# Altium schematic sheet CCD.SchDoc
size A3
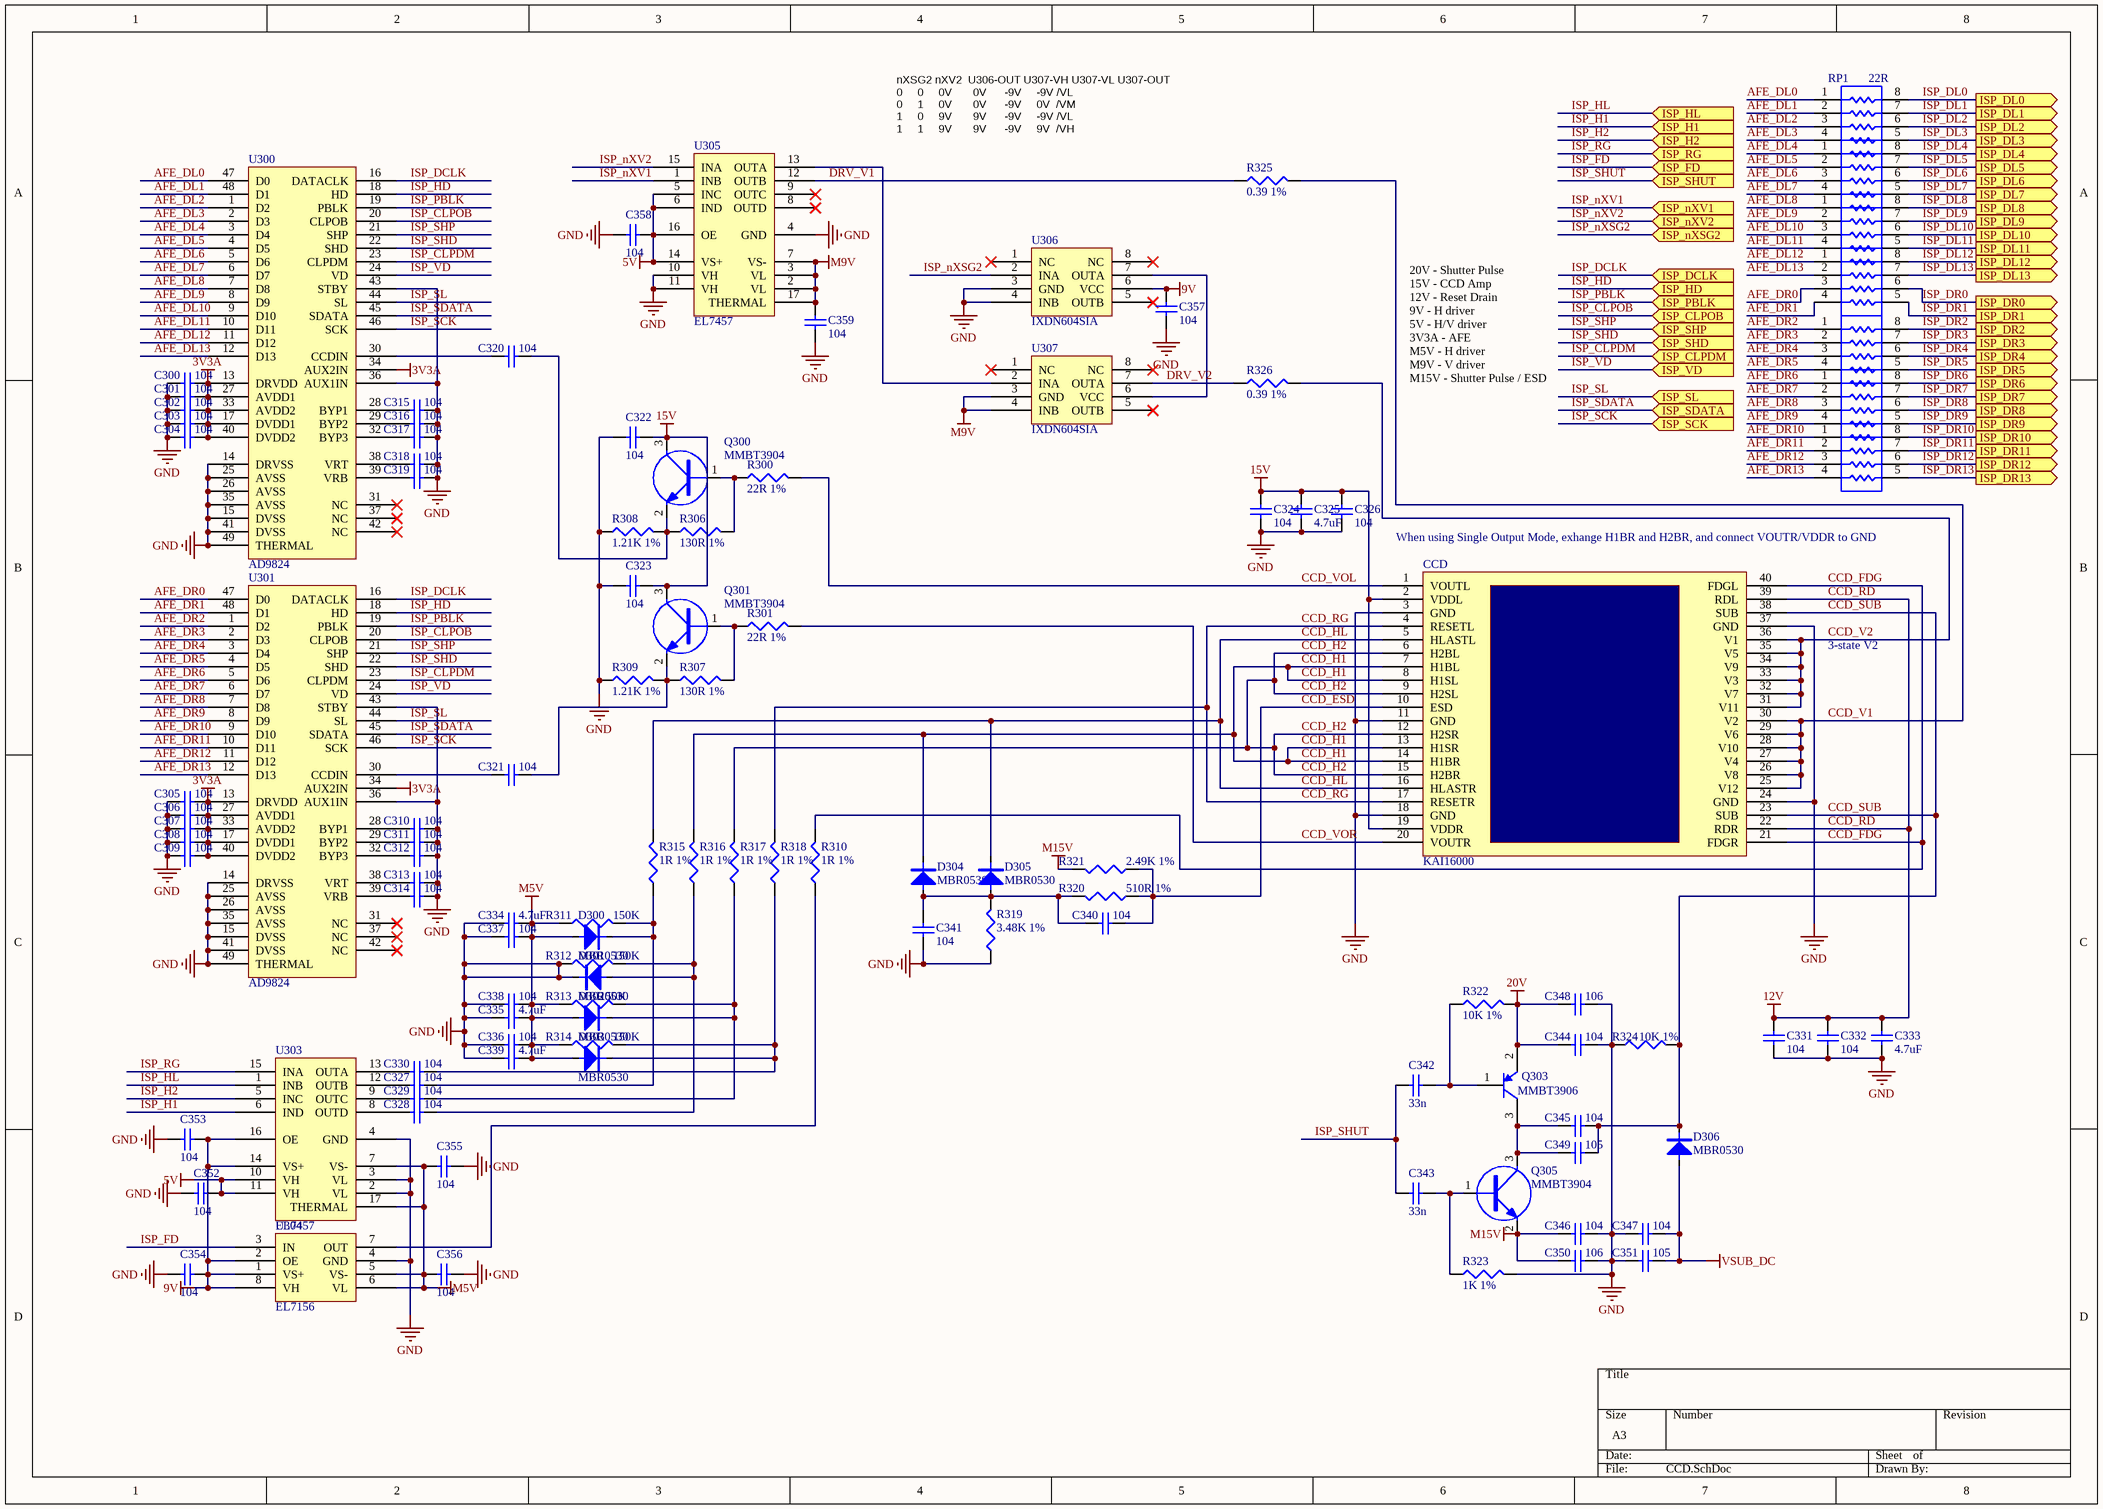
[diagram p0: CCD.SchDoc]

## Parts
C300  104  [C0402]
C301  104  [C0402]
C302  104  [C0402]
C303  104  [C0402]
C304  104  [C0402]
C305  104  [C0402]
C306  104  [C0402]
C307  104  [C0402]
C308  104  [C0402]
C309  104  [C0402]
C310  104  [C0402]
C311  104  [C0402]
C312  104  [C0402]
C313  104  [C0402]
C314  104  [C0402]
C315  104  [C0402]
C316  104  [C0402]
C317  104  [C0402]
C318  104  [C0402]
C319  104  [C0402]
C320  104  [C0402]
C321  104  [C0402]
C322  104  [C0402]
C323  104  [C0402]
C324  104  [C0402]
C325  4.7uF  [C0603]
C326  104  [C0402]
C327  104  [C0402]
C328  104  [C0402]
C329  104  [C0402]
C330  104  [C0402]
C331  104  [C0402]
C332  104  [C0402]
C333  4.7uF  [C0603]
C334  104  [C0603]
C335  4.7uF  [C0603]
C336  104  [C0603]
C337  4.7uF  [C0603]
C338  104  [C0603]
C339  4.7uF  [C0603]
C340  104  [C0603]
C341  104  [C0603]
C342  33n  [C0402]
C343  33n  [C0402]
C344  104  [C0402]
C345  104  [C0402]
C346  104  [C0402]
C347  104  [C0402]
C348  106  [C0805]
C349  105  [C0805]
C350  106  [C0805]
C351  105  [C0805]
C352  104  [C0603]
C353  104  [C0603]
C354  104  [C0603]
C355  104  [C0603]
C356  104  [C0603]
C357  104  [C0603]
C358  104  [C0603]
C359  104  [C0603]
CCD  KAI16000  [KAI16000]
D300  MBR0530  [SOD123]
D301  MBR0530  [SOD123]
D302  MBR0530  [SOD123]
D303  MBR0530  [SOD123]
D304  MBR0530  [SOD123]
D305  MBR0530  [SOD123]
D306  MBR0530  [SOD123]
Q300  MMBT3904  [SOT23]
Q301  MMBT3904  [SOT23]
Q303  MMBT3906  [SOT23]
Q305  MMBT3904  [SOT23]
R300  22R 1%  [R0603]
R301  22R 1%  [R0603]
R306  130R 1%  [R0603]
R307  130R 1%  [R0603]
R308  1.21K 1%  [R0603]
R309  1.21K 1%  [R0603]
R310  1R 1%  [R0805]
R311  150K  [R0603]
R312  150K  [R0603]
R313  150K  [R0603]
R314  150K  [R0603]
R315  1R 1%  [R0805]
R316  1R 1%  [R0805]
R317  1R 1%  [R0805]
R318  1R 1%  [R0805]
R319  3.48K 1%  [R0603]
R320  510R 1%  [R0603]
R321  2.49K 1%  [R0603]
R322  10K 1%  [R0603]
R323  1K 1%  [R0603]
R324  10K 1%  [R0603]
R325  0.39 1%  [R0603]
R326  0.39 1%  [R0603]
RP1  22R  [R0402S4]
RP2  22R  [R0402S4]  (value not drawn)
RP3  22R  [R0402S4]  (value not drawn)
RP4  22R  [R0402S4]  (value not drawn)
RP5  22R  [R0402S4]  (value not drawn)
RP6  22R  [R0402S4]  (value not drawn)
RP7  22R  [R0402S4]  (value not drawn)
U300  AD9824  [CP-48]
U301  AD9824  [CP-48]
U303  EL7457  [QFN16]
U304  EL7156  [SOP-8]
U305  EL7457  [QFN16]
U306  IXDN604SIA  [SOP8]
U307  IXDN604SIA  [SOP8]

## Ports
ISP_CLPDM (in), ISP_CLPOB (in), ISP_DCLK (in), ISP_DL0 (out), ISP_DL1 (out), ISP_DL2 (out), ISP_DL3 (out), ISP_DL4 (out), ISP_DL5 (out), ISP_DL6 (out), ISP_DL7 (out), ISP_DL8 (out), ISP_DL9 (out), ISP_DL10 (out), ISP_DL11 (out), ISP_DL12 (out), ISP_DL13 (out), ISP_DR0 (out), ISP_DR1 (out), ISP_DR2 (out), ISP_DR3 (out), ISP_DR4 (out), ISP_DR5 (out), ISP_DR6 (out), ISP_DR7 (out), ISP_DR8 (out), ISP_DR9 (out), ISP_DR10 (out), ISP_DR11 (out), ISP_DR12 (out), ISP_DR13 (out), ISP_FD (in), ISP_H1 (in), ISP_H2 (in), ISP_HD (in), ISP_HL (in), ISP_nXSG2 (in), ISP_nXV1 (in), ISP_nXV2 (in), ISP_PBLK (in), ISP_RG (in), ISP_SCK (in), ISP_SDATA (in), ISP_SHD (in), ISP_SHP (in), ISP_SHUT (in), ISP_SL (in), ISP_VD (in)

## Nets
3V3A: C300.2 C301.2 C302.2 C303.2 C304.2 C305.2 C306.2 C307.2 C308.2 C309.2 U300.13(DRVDD) U300.17(DVDD1) U300.27(AVDD1) U300.33(AVDD2) U300.34(AUX2IN) U300.40(DVDD2) U301.13(DRVDD) U301.17(DVDD1) U301.27(AVDD1) U301.33(AVDD2) U301.34(AUX2IN) U301.40(DVDD2)
5V: C352.2 C358.2 U303.10(VH) U303.11(VH) U305.5(INC) U305.6(IND) U305.14(VS+) U305.16(OE)
9V: C353.1 C354.1 C357.1 U303.14(VS+) U303.16(OE) U304.1(VS+) U304.2(OE) U304.8(VH) U306.6(VCC)
15V: C322.2 C323.2 C324.2 C325.2 C326.2 CCD.2(VDDL) CCD.19(VDDR) Q300.3(C) Q301.3(C)
20V: C344.1 C348.1 Q303.2(E) R322.2
CCD_RD: C331.2 C332.2 C333.2 CCD.22(RDR) CCD.39(RDL)  [also labelled 12V]
GND: C300.1 C301.1 C302.1 C303.1 C304.1 C305.1 C306.1 C307.1 C308.1 C309.1 C310.2 C311.2 C312.2 C313.2 C314.2 C315.2 C316.2 C317.2 C318.2 C319.2 C322.1 C323.1 C324.1 C325.1 C326.1 C331.1 C332.1 C333.1 C334.1 C335.1 C336.1 C337.1 C338.1 C339.1 C341.1 C344.2 C346.2 C347.1 C348.2 C350.2 C351.1 C352.1 C353.2 C354.2 C355.1 C356.1 C357.2 C358.1 C359.1 CCD.3(GND) CCD.11(GND) CCD.18(GND) CCD.24(GND) CCD.37(GND) D301.2 R308.1 R309.1 R312.1 R319.1 R323.2 R324.1 U300.14(DRVSS) U300.15(DVSS) U300.25(AVSS) U300.26(AVSS) U300.35(AVSS) U300.36(AUX1IN) U300.41(DVSS) U300.43(STBY) U300.49(THERMAL) U301.14(DRVSS) U301.15(DVSS) U301.25(AVSS) U301.26(AVSS) U301.35(AVSS) U301.36(AUX1IN) U301.41(DVSS) U301.43(STBY) U301.49(THERMAL) U303.2(VL) U303.3(VL) U303.4(GND) U304.4(GND) U305.4(GND) U305.10(VH) U305.11(VH) U306.3(GND) U306.4(INB)
M5V: C334.2 C335.2 C336.2 C337.2 C338.2 C339.2 C355.2 C356.2 D300.1 D302.1 D303.1 R311.1 R313.1 R314.1 U303.7(VS-) U303.17(THERMAL) U304.5(VS-) U304.6(VL)
M9V: C359.2 U305.2(VL) U305.3(VL) U305.7(VS-) U305.17(THERMAL) U307.3(GND) U307.4(INB)
M15V: C346.1 C350.1 Q305.2(E) R321.2
VSUB_DC: C347.2 C351.2 D306.1
AFE_DL0: RP1.1 U300.47(D0)
AFE_DL1: RP1.2 U300.48(D1)
AFE_DL2: RP1.3 U300.1(D2)
AFE_DL3: RP1.4 U300.2(D3)
AFE_DL4: RP2.1 U300.3(D4)
AFE_DL5: RP2.2 U300.4(D5)
AFE_DL6: RP2.3 U300.5(D6)
AFE_DL7: RP2.4 U300.6(D7)
AFE_DL8: RP3.1 U300.7(D8)
AFE_DL9: RP3.2 U300.8(D9)
AFE_DL10: RP3.3 U300.9(D10)
AFE_DL11: RP3.4 U300.10(D11)
AFE_DL12: RP4.1 U300.11(D12)
AFE_DL13: RP4.2 U300.12(D13)
AFE_DR0: RP4.3 U301.47(D0)
AFE_DR1: RP4.4 U301.48(D1)
AFE_DR2: RP5.1 U301.1(D2)
AFE_DR3: RP5.2 U301.2(D3)
AFE_DR4: RP5.3 U301.3(D4)
AFE_DR5: RP5.4 U301.4(D5)
AFE_DR6: RP7.1 U301.5(D6)
AFE_DR7: RP7.2 U301.6(D7)
AFE_DR8: RP7.3 U301.7(D8)
AFE_DR9: RP7.4 U301.8(D9)
AFE_DR10: RP6.1 U301.9(D10)
AFE_DR11: RP6.2 U301.10(D11)
AFE_DR12: RP6.3 U301.11(D12)
AFE_DR13: RP6.4 U301.12(D13)
CCD_ESD: C340.2 CCD.10(ESD) R320.1 R321.1
CCD_FDG: CCD.21(FDGR) CCD.40(FDGL) R310.2
CCD_H1: CCD.7(H1BL) CCD.8(H1SL) CCD.13(H1SR) CCD.14(H1BR) D304.2 R316.2
CCD_H2: CCD.6(H2BL) CCD.9(H2SL) CCD.12(H2SR) CCD.15(H2BR) R317.2
CCD_HL: CCD.5(HLASTL) CCD.16(HLASTR) D305.2 R315.2
CCD_RG: CCD.4(RESETL) CCD.17(RESETR) R318.2
CCD_SUB: C345.2 C349.2 CCD.23(SUB) CCD.38(SUB) D306.2 R324.2
CCD_V1: CCD.25(V12) CCD.26(V8) CCD.27(V4) CCD.28(V10) CCD.29(V6) CCD.30(V2) R325.2
CCD_V2: CCD.31(V11) CCD.32(V7) CCD.33(V3) CCD.34(V9) CCD.35(V5) CCD.36(V1) R326.2
CCD_VOL: CCD.1(VOUTL) R300.2
CCD_VOR: CCD.20(VOUTR) R301.2
DRV_V1: R325.1 U305.12(OUTB)
DRV_V2: R326.1 U307.7(OUTA)
ISP_CLPDM: U300.23(CLPDM) U301.23(CLPDM) ; port ISP_CLPDM
ISP_CLPOB: U300.20(CLPOB) U301.20(CLPOB) ; port ISP_CLPOB
ISP_DCLK: U300.16(DATACLK) U301.16(DATACLK) ; port ISP_DCLK
ISP_DL0: RP1.8 ; port ISP_DL0
ISP_DL1: RP1.7 ; port ISP_DL1
ISP_DL2: RP1.6 ; port ISP_DL2
ISP_DL3: RP1.5 ; port ISP_DL3
ISP_DL4: RP2.8 ; port ISP_DL4
ISP_DL5: RP2.7 ; port ISP_DL5
ISP_DL6: RP2.6 ; port ISP_DL6
ISP_DL7: RP2.5 ; port ISP_DL7
ISP_DL8: RP3.8 ; port ISP_DL8
ISP_DL9: RP3.7 ; port ISP_DL9
ISP_DL10: RP3.6 ; port ISP_DL10
ISP_DL11: RP3.5 ; port ISP_DL11
ISP_DL12: RP4.8 ; port ISP_DL12
ISP_DL13: RP4.7 ; port ISP_DL13
ISP_DR0: RP4.6 ; port ISP_DR0
ISP_DR1: RP4.5 ; port ISP_DR1
ISP_DR2: RP5.8 ; port ISP_DR2
ISP_DR3: RP5.7 ; port ISP_DR3
ISP_DR4: RP5.6 ; port ISP_DR4
ISP_DR5: RP5.5 ; port ISP_DR5
ISP_DR6: RP7.8 ; port ISP_DR6
ISP_DR7: RP7.7 ; port ISP_DR7
ISP_DR8: RP7.6 ; port ISP_DR8
ISP_DR9: RP7.5 ; port ISP_DR9
ISP_DR10: RP6.8 ; port ISP_DR10
ISP_DR11: RP6.7 ; port ISP_DR11
ISP_DR12: RP6.6 ; port ISP_DR12
ISP_DR13: RP6.5 ; port ISP_DR13
ISP_FD: U304.3(IN) ; port ISP_FD
ISP_H1: U303.6(IND) ; port ISP_H1
ISP_H2: U303.5(INC) ; port ISP_H2
ISP_HD: U300.18(HD) U301.18(HD) ; port ISP_HD
ISP_HL: U303.1(INB) ; port ISP_HL
ISP_nXSG2: U306.2(INA) ; port ISP_nXSG2
ISP_nXV1: U305.1(INB) ; port ISP_nXV1
ISP_nXV2: U305.15(INA) ; port ISP_nXV2
ISP_PBLK: U300.19(PBLK) U301.19(PBLK) ; port ISP_PBLK
ISP_RG: U303.15(INA) ; port ISP_RG
ISP_SCK: U300.46(SCK) U301.46(SCK) ; port ISP_SCK
ISP_SDATA: U300.45(SDATA) U301.45(SDATA) ; port ISP_SDATA
ISP_SHD: U300.22(SHD) U301.22(SHD) ; port ISP_SHD
ISP_SHP: U300.21(SHP) U301.21(SHP) ; port ISP_SHP
ISP_SHUT: C342.1 C343.1 ; port ISP_SHUT
ISP_SL: U300.44(SL) U301.44(SL) ; port ISP_SL
ISP_VD: U300.24(VD) U301.24(VD) ; port ISP_VD
NetC310_1: C310.1 U301.28(BYP1)
NetC311_1: C311.1 U301.29(BYP2)
NetC312_1: C312.1 U301.32(BYP3)
NetC313_1: C313.1 U301.38(VRT)
NetC314_1: C314.1 U301.39(VRB)
NetC315_1: C315.1 U300.28(BYP1)
NetC316_1: C316.1 U300.29(BYP2)
NetC317_1: C317.1 U300.32(BYP3)
NetC318_1: C318.1 U300.38(VRT)
NetC319_1: C319.1 U300.39(VRB)
NetC320_1: C320.1 U300.30(CCDIN)
NetC320_2: C320.2 Q300.2(E) R306.1 R308.2
NetC321_1: C321.1 U301.30(CCDIN)
NetC321_2: C321.2 Q301.2(E) R307.1 R309.2
NetC327_1: C327.1 U303.12(OUTB)
NetC327_2: C327.2 D300.2 R311.2 R315.1
NetC328_1: C328.1 U303.8(OUTD)
NetC328_2: C328.2 D301.1 R312.2 R316.1
NetC329_1: C329.1 U303.9(OUTC)
NetC329_2: C329.2 D302.2 R313.2 R317.1
NetC330_1: C330.1 U303.13(OUTA)
NetC330_2: C330.2 D303.2 R314.2 R318.1
NetC340_1: C340.1 C341.2 D304.1 D305.1 R319.2 R320.2
NetC342_2: C342.2 Q303.1(B) R322.1
NetC343_2: C343.2 Q305.1(B) R323.1
NetC345_1: C345.1 C349.1 Q303.3(C) Q305.3(C)
NetQ300_1: Q300.1(B) R300.1 R306.2
NetQ301_1: Q301.1(B) R301.1 R307.2
NetR310_1: R310.1 U304.7(OUT)
NetU305_13: U305.13(OUTA) U307.2(INA)
NetU306_7: U306.7(OUTA) U307.6(VCC)

Not connected (* = marked no-connect by the designer): U300 31(NC)* 37(NC)* 42(NC)*; U301 31(NC)* 37(NC)* 42(NC)*; U305 8(OUTD)* 9(OUTC)*; U306 1(NC)* 5(OUTB)* 8(NC)*; U307 1(NC)* 5(OUTB)* 8(NC)*

## Notes on the sheet
- nXSG2 nXV2  U306-OUT U307-VH U307-VL U307-OUT
  0     0     0V       0V      -9V     -9V /VL
  0     1     0V       0V      -9V     0V  /VM
  1     0     9V       9V      -9V     -9V /VL
  1     1     9V       9V      -9V     9V  /VH
- 20V - Shutter Pulse
  15V - CCD Amp
  12V - Reset Drain
  9V - H driver
  5V - H/V driver
  3V3A - AFE
  M5V - H driver
  M9V - V driver
  M15V - Shutter Pulse / ESD
- When using Single Output Mode, exhange H1BR and H2BR, and connect VOUTR/VDDR to GND
- 3-state V2

## Library data of the parts
C300-C359 = Cap Semi: Capacitor (Semiconductor SIM Model); Value: 100pF; Published: 8-Jun-2000; LatestRevisionDate: 29-May-2009; LatestRevisionNote: IPC-7351 Footprint Added.; PackageReference: C1206; Publisher: Altium Limited; PackageDescription: Chip Capacitor
R300 R301 R306-R322 R324-R326 = Res3: Resistor; Value: 1K; Published: 8-Jun-2000; LatestRevisionDate: 29-May-2009; LatestRevisionNote: IPC-7351 Footprint Added.; PackageReference: J1-0603; Publisher: Altium Limited; PackageDescription: Chip Resistor
R323 = Res3: Resistor; Published: 8-Jun-2000; LatestRevisionDate: 29-May-2009; LatestRevisionNote: IPC-7351 Footprint Added.; PackageReference: J1-0603; Publisher: Altium Limited; PackageDescription: Chip Resistor; Value: 1K
RP1-RP7 = ResPack: Isolated Resistor Network; Value: 1K; Published: 24-Mar-1999; LatestRevisionDate: 29-May-2009; LatestRevisionNote: IPC-7351 Footprint Added.; PackageReference: SO-16; Publisher: Altium Limited; PackageDescription: 16-Pin Small Outline Integrated Circuit 1.27 mm Pitch; Code_JEDEC: MS-012-AC; Code_IPC: SOIC127P600-16
Q303 = MMBT3906: Published: 8-Jun-2000; LatestRevisionDate: 29-May-2009; LatestRevisionNote: IPC-7351 Footprint Added.; PackageVersion: Aug-1999; PackageReference: SOT-23B; Publisher: Altium Limited; PackageDescription: 3-Pin SOT-23 Package 0.95 mm Pitch, 2.4 mm Lead Span